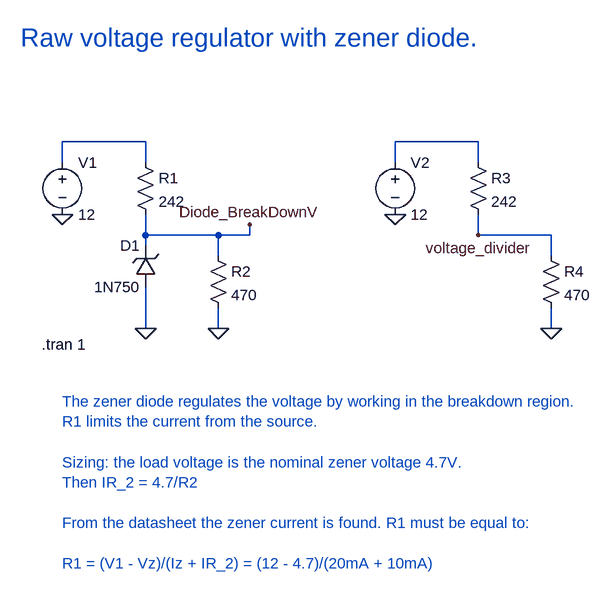
[diagram p0: schematic Raw-voltage-regulator-with-zener-diode..asc]
Raw-voltage-regulator-with-zener-diode..asc, the LTspice schematic file:
Version 4.1
SHEET 1 1392 1008
WIRE 352 128 224 128
WIRE 864 128 736 128
WIRE 224 160 224 128
WIRE 352 160 352 128
WIRE 736 160 736 128
WIRE 864 160 864 128
WIRE 352 272 352 240
WIRE 464 272 352 272
WIRE 512 272 512 256
WIRE 512 272 464 272
WIRE 864 272 864 240
WIRE 976 272 864 272
WIRE 352 288 352 272
WIRE 464 304 464 272
WIRE 976 304 976 272
WIRE 352 416 352 352
WIRE 464 416 464 384
WIRE 976 416 976 384
FLAG 224 240 0
FLAG 352 416 0
FLAG 464 416 0
FLAG 736 240 0
FLAG 976 416 0
FLAG 864 272 voltage_divider
FLAG 512 256 Diode_BreakDownV
SYMBOL zener 368 352 R180
WINDOW 0 24 64 Left 2
WINDOW 3 24 0 Left 2
SYMATTR InstName D1
SYMATTR Value 1N750
SYMBOL res 336 144 R0
SYMATTR InstName R1
SYMATTR Value 242
SYMBOL voltage 224 144 R0
WINDOW 123 0 0 Left 2
WINDOW 39 0 0 Left 2
SYMATTR InstName V1
SYMATTR Value 12
SYMBOL res 448 288 R0
SYMATTR InstName R2
SYMATTR Value 470
SYMBOL res 848 144 R0
SYMATTR InstName R3
SYMATTR Value 242
SYMBOL voltage 736 144 R0
WINDOW 123 0 0 Left 2
WINDOW 39 0 0 Left 2
SYMATTR InstName V2
SYMATTR Value 12
SYMBOL res 960 288 R0
SYMATTR InstName R4
SYMATTR Value 470
TEXT 160 -32 Left 4 ;Raw voltage regulator with zener diode.
TEXT 224 528 Left 2 ;The zener diode regulates the voltage by working in the breakdown region.\nR1 limits the current from the source.\n \nSizing: the load voltage is the nominal zener voltage 4.7V.\nThen IR_2 = 4.7/R2\n \nFrom the datasheet the zener current is found. R1 must be equal to:\n \nR1 = (V1 - Vz)/(Iz + IR_2) = (12 - 4.7)/(20mA + 10mA)
TEXT 192 440 Left 2 !.tran 1

The netlist it stands for:
* Raw-voltage-regulator-with-zener-diode..asc
D1 0 Diode_BreakDownV 1N750
R1 N001 Diode_BreakDownV 242
V1 N001 0 12
R2 Diode_BreakDownV 0 470
R3 N002 voltage_divider 242
V2 N002 0 12
R4 voltage_divider 0 470
.model D D
.lib standard.dio
* Raw voltage regulator with zener diode.
* The zener diode regulates the voltage by working in the breakdown region.
* R1 limits the current from the source.
* Sizing: the load voltage is the nominal zener voltage 4.7V.
* Then IR_2 = 4.7/R2
* From the datasheet the zener current is found. R1 must be equal to:
* R1 = (V1 - Vz)/(Iz + IR_2) = (12 - 4.7)/(20mA + 10mA)
.tran 1
.backanno
.end